# EAGLE design atxx4-485 (EAGLE 5.07)
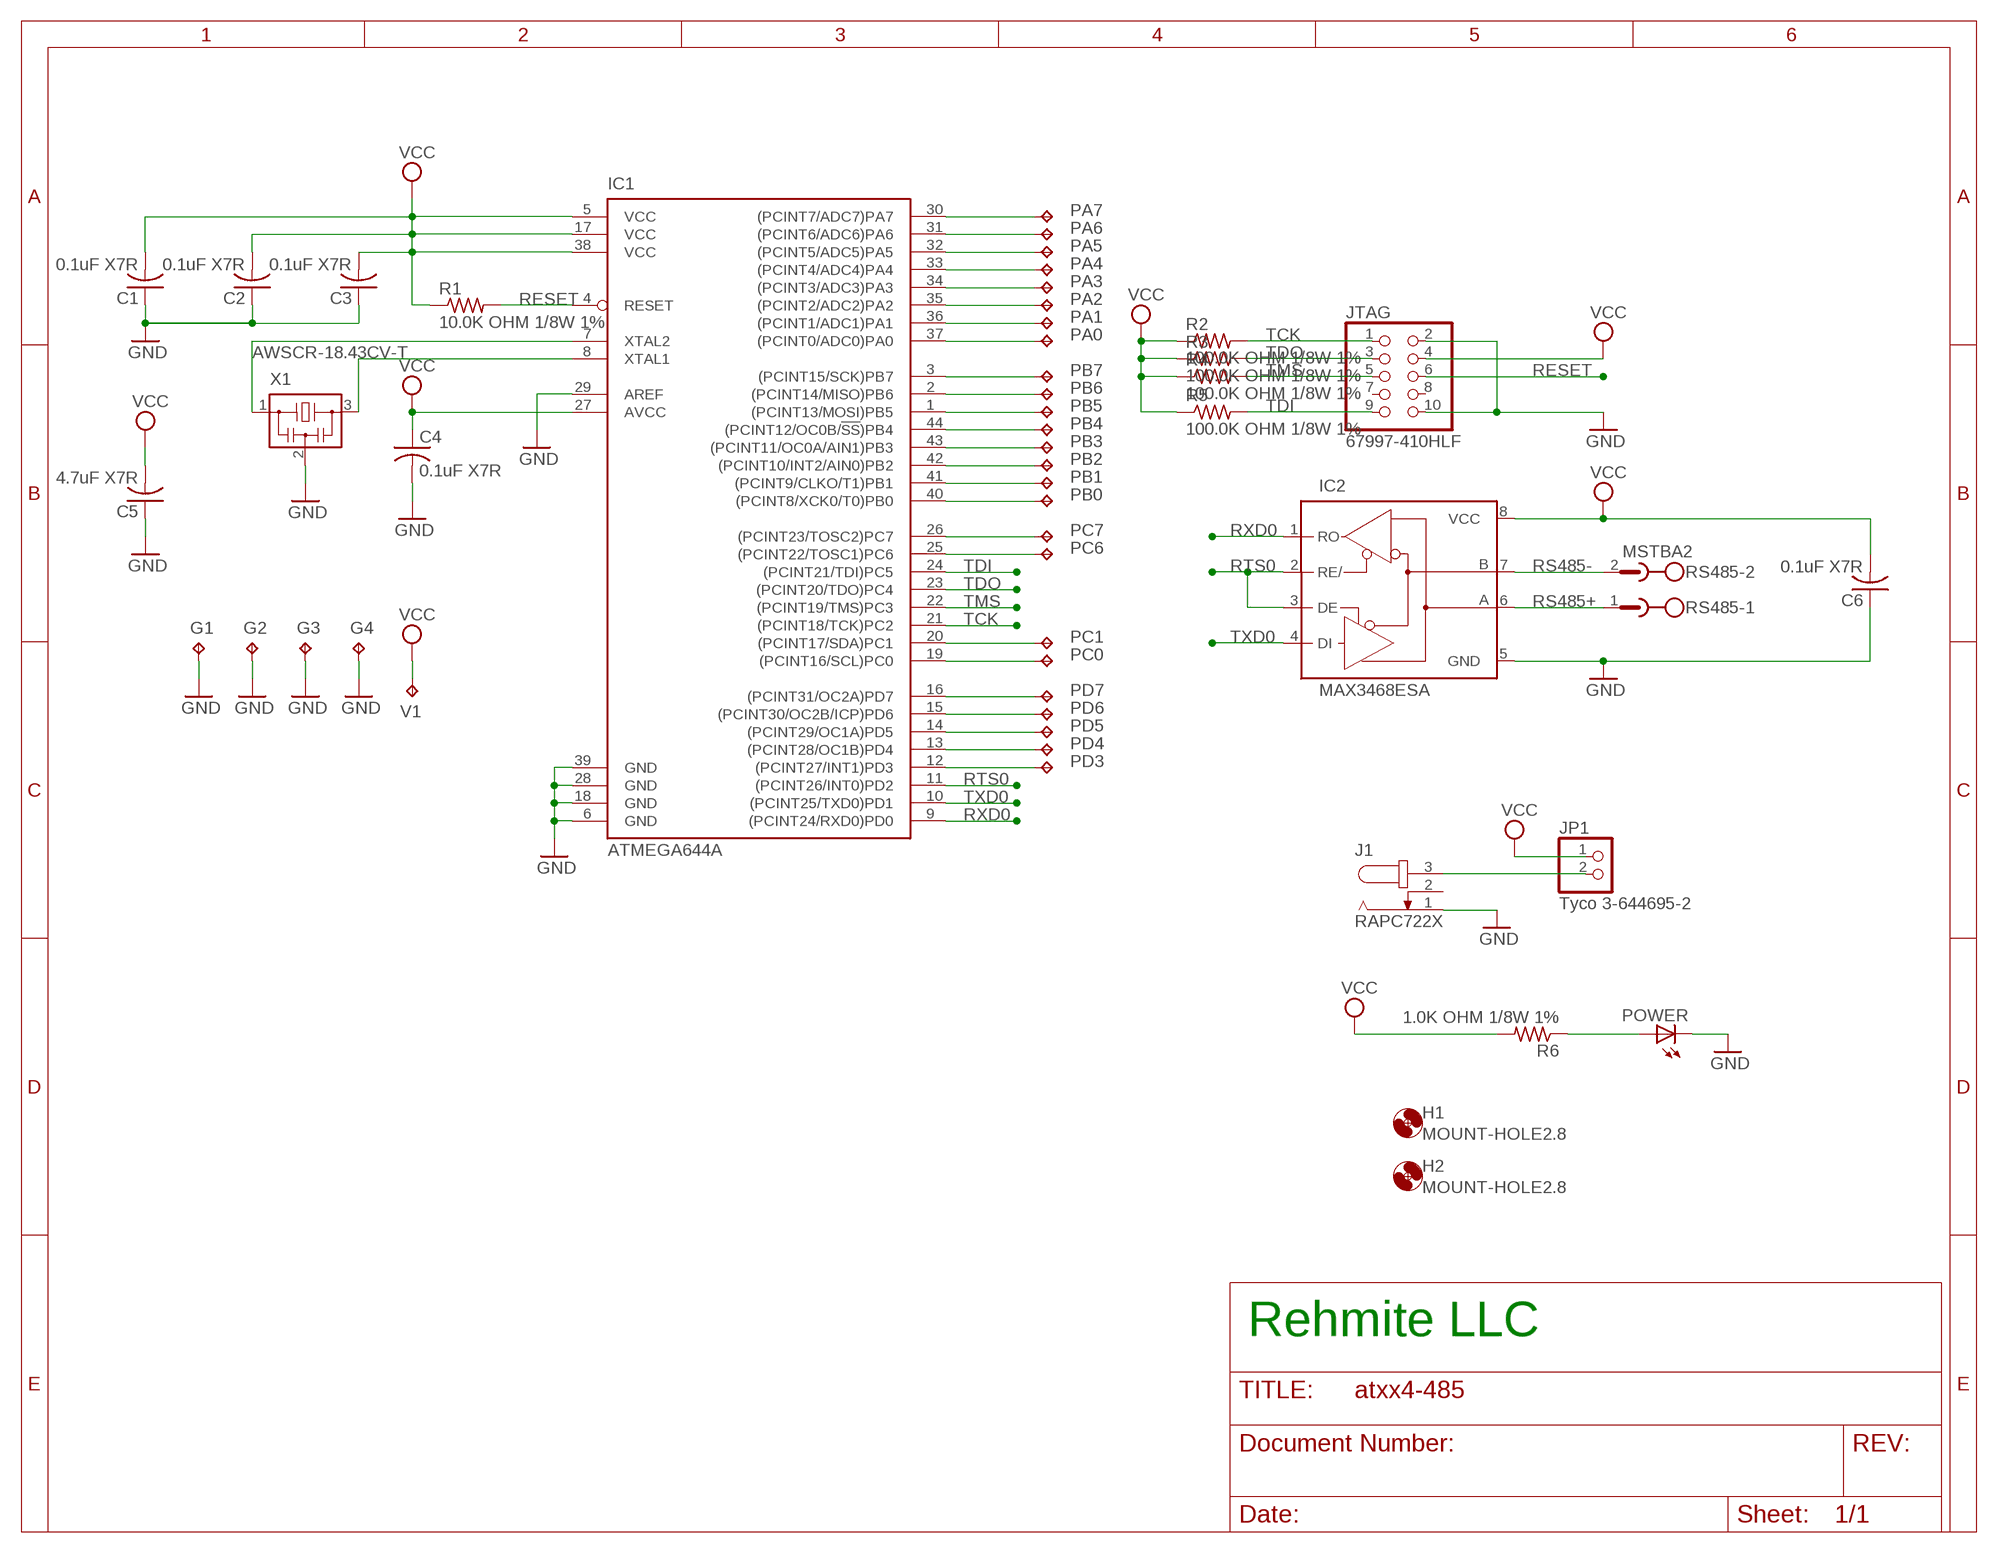
[diagram p0: schematic, sheet 1]

## Parts
C1  0.1uF X7R  C-USC0805  [C0805]
C2  0.1uF X7R  C-USC0805  [C0805]
C3  0.1uF X7R  C-USC0805  [C0805]
C4  0.1uF X7R  C-USC0805  [C0805]
C5  4.7uF X7R  C-USC0805  [C0805]
C6  0.1uF X7R  C-USC0805  [C0805]
G1  TPPAD1-13  [P1-13]
G2  TPPAD1-13  [P1-13]
G3  TPPAD1-13  [P1-13]
G4  TPPAD1-13  [P1-13]
H1  MOUNT-HOLE2.8  [2,8]
H2  MOUNT-HOLE2.8  [2,8]
IC1  ATMEGA644A  [TQFP44]
IC2  MAX3468ESA  [SO08]
J1  RAPC722X  JACK-PLUG0  [SPC4077]
JP1  Tyco 3-644695-2  PINHD-1X2  [1X02]
JTAG  67997-410HLF  PINHD-2X5  [2X05]
PA0  TPPAD1-13  [P1-13]
PA1  TPPAD1-13  [P1-13]
PA2  TPPAD1-13  [P1-13]
PA3  TPPAD1-13  [P1-13]
PA4  TPPAD1-13  [P1-13]
PA5  TPPAD1-13  [P1-13]
PA6  TPPAD1-13  [P1-13]
PA7  TPPAD1-13  [P1-13]
PB0  TPPAD1-13  [P1-13]
PB1  TPPAD1-13  [P1-13]
PB2  TPPAD1-13  [P1-13]
PB3  TPPAD1-13  [P1-13]
PB4  TPPAD1-13  [P1-13]
PB5  TPPAD1-13  [P1-13]
PB6  TPPAD1-13  [P1-13]
PB7  TPPAD1-13  [P1-13]
PC0  TPPAD1-13  [P1-13]
PC1  TPPAD1-13  [P1-13]
PC6  TPPAD1-13  [P1-13]
PC7  TPPAD1-13  [P1-13]
PD3  TPPAD1-13  [P1-13]
PD4  TPPAD1-13  [P1-13]
PD5  TPPAD1-13  [P1-13]
PD6  TPPAD1-13  [P1-13]
PD7  TPPAD1-13  [P1-13]
POWER  LED3MM  [LED3MM]
R1  10.0K OHM 1/8W 1%  R-US_R0805  [R0805]
R2  100.0K OHM 1/8W 1%  R-US_R0805  [R0805]
R3  100.0K OHM 1/8W 1%  R-US_R0805  [R0805]
R4  100.0K OHM 1/8W 1%  R-US_R0805  [R0805]
R5  100.0K OHM 1/8W 1%  R-US_R0805  [R0805]
R6  1.0K OHM 1/8W 1%  R-US_R0805  [R0805]
RS485  MSTBA2  [MSTBA2]
V1  TPPAD1-13  [P1-13]
X1  AWSCR-18.43CV-T  SWSCR-CV  [AWSCR-CV]

## Nets
GND: C1.1 C2.1 C3.1 C4.2 C5.1 C6.1 G1.TP G2.TP G3.TP G4.TP IC1.6(GND) IC1.18(GND) IC1.28(GND) IC1.29(AREF) IC1.39(GND) IC2.5(GND) J1.1 JTAG.2 JTAG.10 POWER.K(C) X1.2
N$1: IC1.3((PCINT15/SCK)PB7) PB7.TP
N$2: IC1.2((PCINT14/MISO)PB6) PB6.TP
N$3: IC1.37((PCINT0/ADC0)PA0) PA0.TP
N$4: IC1.36((PCINT1/ADC1)PA1) PA1.TP
N$5: IC1.35((PCINT2/ADC2)PA2) PA2.TP
N$6: IC1.34((PCINT3/ADC3)PA3) PA3.TP
N$7: IC1.33((PCINT4/ADC4)PA4) PA4.TP
N$8: IC1.32((PCINT5/ADC5)PA5) PA5.TP
N$9: IC1.31((PCINT6/ADC6)PA6) PA6.TP
N$10: IC1.30((PCINT7/ADC7)PA7) PA7.TP
N$11: IC1.44((PCINT12/OC0B/!SS!)PB4) PB4.TP
N$12: IC1.43((PCINT11/OC0A/AIN1)PB3) PB3.TP
N$13: IC1.42((PCINT10/INT2/AIN0)PB2) PB2.TP
N$14: IC1.41((PCINT9/CLKO/T1)PB1) PB1.TP
N$15: POWER.A R6.1
N$16: IC1.40((PCINT8/XCK0/T0)PB0) PB0.TP
N$17: IC1.26((PCINT23/TOSC2)PC7) PC7.TP
N$18: IC1.25((PCINT22/TOSC1)PC6) PC6.TP
N$19: IC1.1((PCINT13/MOSI)PB5) PB5.TP
N$20: IC1.7(XTAL2) X1.1
N$21: IC1.8(XTAL1) X1.3
N$22: J1.3 JP1.2
N$23: IC1.20((PCINT17/SDA)PC1) PC1.TP
N$24: IC1.19((PCINT16/SCL)PC0) PC0.TP
N$25: IC1.16((PCINT31/OC2A)PD7) PD7.TP
N$26: IC1.15((PCINT30/OC2B/ICP)PD6) PD6.TP
N$27: IC1.14((PCINT29/OC1A)PD5) PD5.TP
N$28: IC1.13((PCINT28/OC1B)PD4) PD4.TP
N$29: IC1.12((PCINT27/INT1)PD3) PD3.TP
RESET: IC1.4(RESET) JTAG.6 R1.2
RS485+: IC2.6(A) RS485.1
RS485-: IC2.7(B) RS485.2
RTS0: IC1.11((PCINT26/INT0)PD2) IC2.2(RE/) IC2.3(DE)
RXD0: IC1.9((PCINT24/RXD0)PD0) IC2.1(RO)
TCK: IC1.21((PCINT18/TCK)PC2) JTAG.1 R2.2
TDI: IC1.24((PCINT21/TDI)PC5) JTAG.9 R5.2
TDO: IC1.23((PCINT20/TDO)PC4) JTAG.3 R3.2
TMS: IC1.22((PCINT19/TMS)PC3) JTAG.5 R4.2
TXD0: IC1.10((PCINT25/TXD0)PD1) IC2.4(DI)
VCC: C1.2 C2.2 C3.2 C4.1 C5.2 C6.2 IC1.5(VCC) IC1.17(VCC) IC1.27(AVCC) IC1.38(VCC) IC2.8(VCC) JP1.1 JTAG.4 R1.1 R2.1 R3.1 R4.1 R5.1 R6.2 V1.TP
Unconnected: J1.2 JTAG.7 JTAG.8

## Notes on the sheet
- Rehmite LLC

## Library data of the parts
C1-C6 = rcl:C-US: CAPACITOR, American symbol
G1-G4 PA0 PA1-PA7 PB0 PB1-PB7 PC0 PC1 PC6 PC7 PD3-PD7 V1 = testpad:TP: Test pad
H1 H2 = holes:MOUNT-HOLE: MOUNTING HOLE with drill center marker
IC1 = atmel:ATMEGA644: 8-bit Microcontroller with 64K Bytes In-System Programmable Flash Source: http://www.atmel.com/dyn/resources/prod_documents/doc2593.pdf
IC2 = maxim:MAX34*: +5V, Fail-Safe, 40Mbps, Profibus RS-485/RS-422 Transceivers Source: MAX3465-MAX3469.pdf
J1 = con-jack:JACK-PLUG: DC POWER JACK Power Jack, DC, Right Angle, Through Hole, Rated 5A at 16VDC, PC Terminals Distributor: Farnell (www.Farnell.de) Drawing: 84N1161.pdf / 84N1162.pdf Manufacturer: SPC Technology (www.spctechnology.com) Type: SPC4077 / SPC 4078
JP1 = pinhead:PINHD-1X2: PIN HEADER
JTAG = pinhead:PINHD-2X5: PIN HEADER
POWER = led:LED: LED OSRAM: - CHIPLED LG R971, LG N971, LY N971, LG Q971, LY Q971, LO R971, LY R971 LH N974, LH R974 LS Q976, LO Q976, LY Q976 LO Q996 - Hyper CHIPLED LW Q18S LB Q993, LB Q99A, LB R99A - SideLED LS A670, LO A670, LY A670, LG A670, LP A670 LB A673, LV A673, LT A673, LW A673 LH A674 LY A675 LS A676, LA A676, LO A676, LY A676, LW A676 LS A679, LY A679, LG A679 - Hyper Micro SIDELED® LS Y876, LA Y876, LO Y876, LY Y876 LT Y87S - SmartLED LW L88C, LW L88S LB L89C, LB L89S, LG L890 LS L89K, LO L89K, LY L89K LS L896, LA L896, LO L896, LY L896 - TOPLED LS T670, LO T670, LY T670, LG T670, LP T670 LSG T670, LSP T670, LSY T670, LOP T670, LYG T670 LG T671, LOG T671, LSG T671 LB T673, LV T673, LT T673, LW T673 LH T674 LS T676, LA T676, LO T676, LY T676, LB T676, LH T676, LSB T676, LW T676 LB T67C, LV T67C, LT T67C, LS T67K, LO T67K, LY T67K, LW E67C LS E67B, LA E67B, LO E67B, LY E67B, LB E67C, LV E67C, LT E67C LW T67C LS T679, LY T679, LG T679 LS T770, LO T770, LY T770, LG T770, LP T770 LB T773, LV T773, LT T773, LW T773 LH T774 LS E675, LA E675, LY E675, LS T675 LS T776, LA T776, LO T776, LY T776, LB T776 LHGB T686 LT T68C, LB T68C - Hyper Mini TOPLED® LB M676 - Mini TOPLED Santana® LG M470 LS M47K, LO M47K, LY M47K Source: http://www.osram.convergy.de LUXEON: - LUMILED® LXK2-PW12-R00, LXK2-PW12-S00, LXK2-PW14-U00, LXK2-PW14-V00 LXK2-PM12-R00, LXK2-PM12-S00, LXK2-PM14-U00 LXK2-PE12-Q00, LXK2-PE12-R00, LXK2-PE12-S00, LXK2-PE14-T00, LXK2-PE14-U00 LXK2-PB12-K00, LXK2-PB12-L00, LXK2-PB12-M00, LXK2-PB14-N00, LXK2-PB14-P00, LXK2-PB14-Q00 LXK2-PR12-L00, LXK2-PR12-M00, LXK2-PR14-Q00, LXK2-PR14-R00 LXK2-PD12-Q00, LXK2-PD12-R00, LXK2-PD12-S00 LXK2-PH12-R00, LXK2-PH12-S00 LXK2-PL12-P00, LXK2-PL12-Q00, LXK2-PL12-R00 Source: www.luxeon.com KINGBRIGHT: KA-3528ASYC Source: www.kingbright.com
R1-R6 = rcl:R-US_: RESISTOR, American symbol
RS485 = con-phoenix-508:MSTBA2: PHOENIX
X1 = resonator-smd:SWSCR-CV: Abracon Resonator Source: http://www.abracon.com/Resonators/AWSCR_CV.pdf

## Board
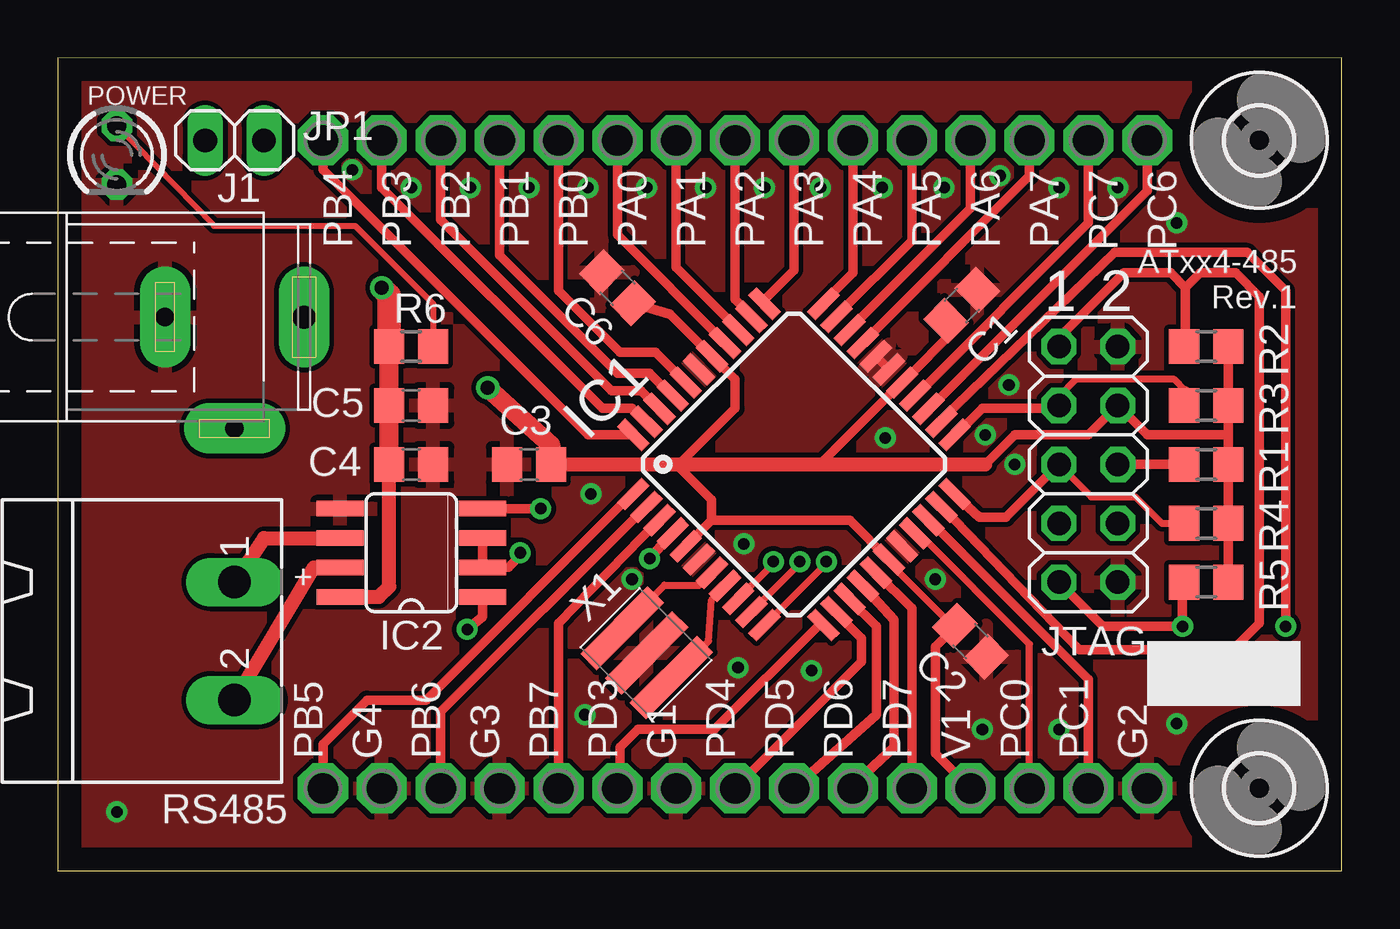
[diagram p1: board, top side]
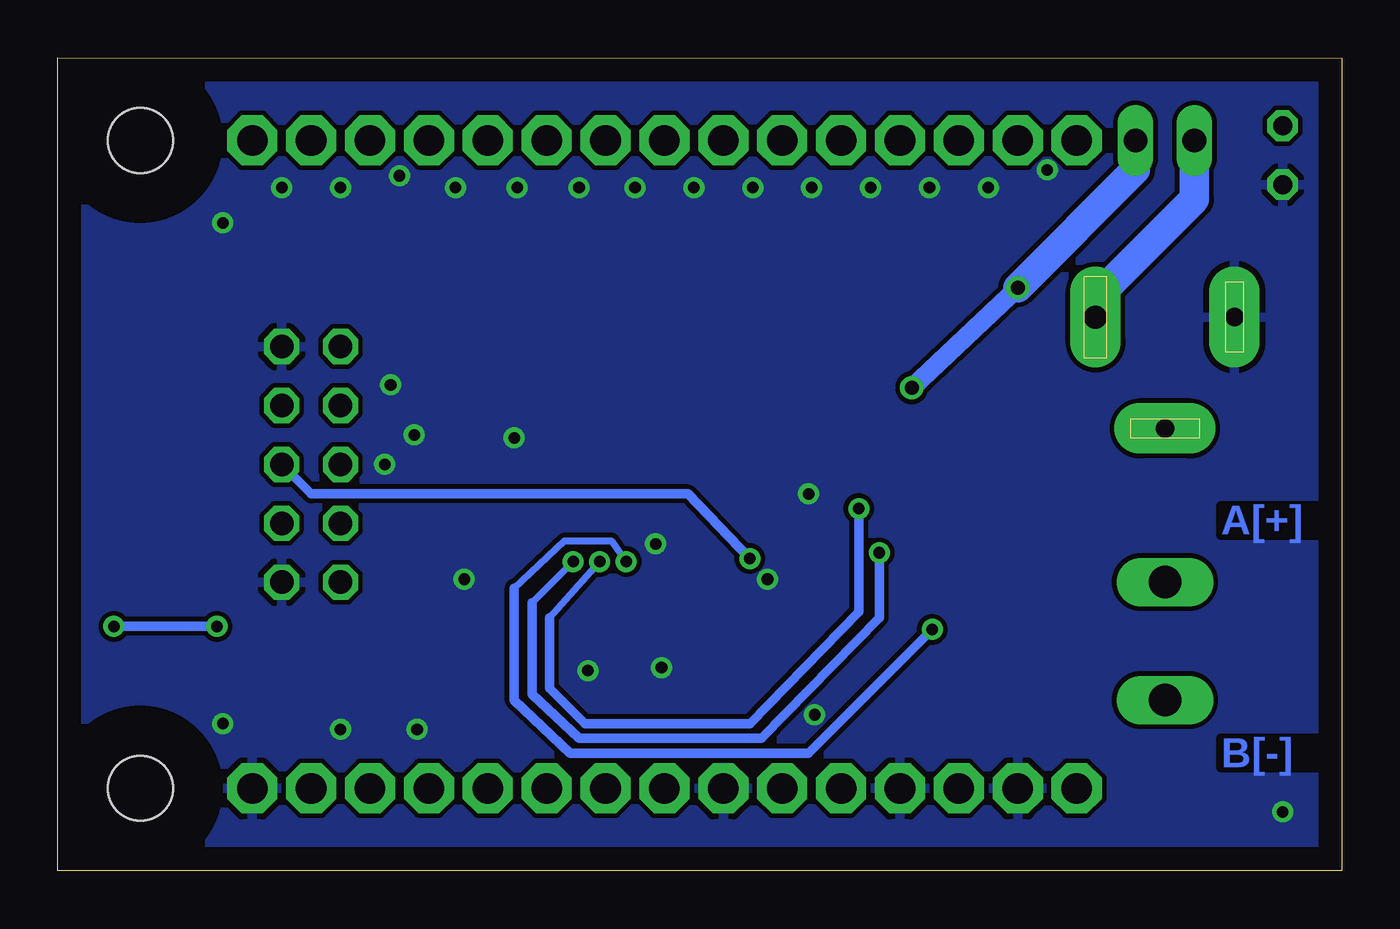
[diagram p2: board, bottom side, seen from below]

Size 55.37 x 35.05 mm. Coordinates in mm from the lower left corner, seen from the top.
Outline: 0,0 55.37,0 55.37,35.05 0,35.04 0,0
Copper layers (1*16): Top 0.035mm / dielectric 1.5mm / Bottom 0.035mm
Design rules "default *": minimum track width 10mil, minimum drill 19mil, track to track 8mil, track to pad 8mil, pad to pad 8mil, via to via 8mil, smd to smd 8mil, copper to edge 40mil, drill to drill 8mil, minimum pad ring 10mil, minimum via ring 8mil, stop-mask expansion 4mil, vias tented up to drill 0mil, thermal gap 10mil
bKeepout: area 22.7,6.6 to 28.3,12.3

### Footprints (pad centres in the part's own frame; a part is rotated, then mirrored left to right if it is on the bottom)
C0805 = smd 1.3 x 1.5: 1 -0.95,0; 2 0.95,0
P1-13 = drill 1.321 pad 2.159 octagon: TP 0,0
2,8 = hole 2.8: 0,0
TQFP44 = smd 1.5 x 0.5: 1 -5.8,4; 2 -5.8,3.2; 3 -5.8,2.4; 4 -5.8,1.6; 5 -5.8,0.8; 6 -5.8,0; 7 -5.8,-0.8; 8 -5.8,-1.6; 9 -5.8,-2.4; 10 -5.8,-3.2; 11 -5.8,-4; 23 5.8,-4; 24 5.8,-3.2; 25 5.8,-2.4; 26 5.8,-1.6; 27 5.8,-0.8; 28 5.8,0; 29 5.8,0.8; 30 5.8,1.6; 31 5.8,2.4; 32 5.8,3.2; 33 5.8,4 | smd 0.5 x 1.5: 12 -4,-5.8; 13 -3.2,-5.8; 14 -2.4,-5.8; 15 -1.6,-5.8; 16 -0.8,-5.8; 17 0,-5.8; 18 0.8,-5.8; 19 1.6,-5.8; 20 2.4,-5.8; 21 3.2,-5.8; 22 4,-5.8; 34 4,5.8; 35 3.2,5.8; 36 2.4,5.8; 37 1.6,5.8; 38 0.8,5.8; 39 0,5.8; 40 -0.8,5.8; 41 -1.6,5.8; 42 -2.4,5.8; 43 -3.2,5.8; 44 -4,5.8
SO08 = smd 0.66 x 2.032: 1 -1.905,-3.073; 2 -0.635,-3.073; 3 0.635,-3.073; 4 1.905,-3.073; 5 1.905,3.073; 6 0.635,3.073; 7 -0.635,3.073; 8 -1.905,3.073
SPC4077 = drill 0.8 pad 2.184 long: 1 -3,0; 2 0,-4.8 | drill 1 pad 2.184 long: 3 3,0
1X02 = drill 1.016 long: 1 -1.27,0; 2 1.27,0
2X05 = drill 1.016 octagon: 1 -5.08,-1.27; 2 -5.08,1.27; 3 -2.54,-1.27; 4 -2.54,1.27; 5 0,-1.27; 6 0,1.27; 7 2.54,-1.27; 8 2.54,1.27; 9 5.08,-1.27; 10 5.08,1.27
LED3MM = drill 0.813 octagon: A -1.27,0; K 1.27,0
R0805 = smd 1.3 x 1.5: 1 -0.95,0; 2 0.95,0
MSTBA2 = drill 1.397 long: 1 -2.54,5.08; 2 2.54,5.08
AWSCR-CV = smd 1 x 4.1: 1 -1.5,0; 2 0,0; 3 1.5,0

### Placement (x,y rotation side)
C1  38.99,24.38 225 top
C2  39.37,9.91 135 top
C3  20.32,17.53 0 top
C4  15.24,17.53 0 top
C5  15.24,20.07 180 top
C6  24.13,25.15 315 top
G1  26.67,3.56 0 top
G2  46.99,3.56 0 top
G3  19.05,3.56 0 top
G4  13.97,3.56 0 top
H1  51.82,3.56 0 top
H2  51.82,31.5 0 top
IC1  31.75,17.53 45 top
IC2  15.24,13.72 90 top
J1  7.62,23.88 0 top
JP1  7.62,31.5 180 top
JTAG  44.45,17.53 270 top
PA0  24.13,31.5 0 top
PA1  26.67,31.5 0 top
PA2  29.21,31.5 0 top
PA3  31.75,31.5 0 top
PA4  34.29,31.5 0 top
PA5  36.83,31.5 0 top
PA6  39.37,31.5 0 top
PA7  41.91,31.5 0 top
PB0  21.59,31.5 0 top
PB1  19.05,31.5 0 top
PB2  16.51,31.5 0 top
PB3  13.97,31.5 0 top
PB4  11.43,31.5 0 top
PB5  11.43,3.56 0 top
PB6  16.51,3.56 0 top
PB7  21.59,3.56 0 top
PC0  41.91,3.56 0 top
PC1  44.45,3.56 0 top
PC6  46.99,31.5 0 top
PC7  44.45,31.5 0 top
PD3  24.13,3.56 0 top
PD4  29.21,3.56 0 top
PD5  31.75,3.56 0 top
PD6  34.29,3.56 0 top
PD7  36.83,3.56 0 top
POWER  2.54,30.86 270 top
R1  49.53,17.53 180 top
R2  49.53,22.61 180 top
R3  49.53,20.07 180 top
R4  49.53,14.99 180 top
R5  49.53,12.45 180 top
R6  15.24,22.61 180 top
RS485  2.54,9.91 270 top
V1  39.37,3.56 0 top
X1  25.4,9.4 315 top

### Tracks (layer width: path | path; a pad name or v marks a point on that pad's centre or on a via)
GND  (via drill 0.5)
  Top 0.406: IC1.29 IC1.28
  other vias: 2.54,2.54 15.24,29.46 17.78,29.46 20.32,29.46 22.86,29.46 25.4,29.46 27.94,29.46 30.48,29.46 32.89,29.46 35.56,29.46 38.23,29.46 40.64,29.97 43.18,29.46 45.72,29.46 48.26,27.94 48.26,6.35 39.88,6.1 43.18,6.1 29.34,8.76 29.59,14.1 37.85,12.57 32.51,8.64 22.99,16.26 35.69,18.67 22.73,6.73 12.7,30.23 41.02,20.95 40.01,18.8 41.27,17.53 24.77,12.57
  pour Bottom: 0,35.05 55.37,35.05 55.37,0 0,0
  pour Top: 0,35.05 0,0 55.37,0 55.37,35.05
N$1
  Top 0.406: IC1.3 25.92,15.12 21.59,10.67 PB7.TP
N$2
  Top 0.406: IC1.2 25.34,15.69 16.51,6.86 PB6.TP
N$3
  Top 0.406: IC1.37 28.78,22.78 24.13,27.43 PA0.TP
N$4
  Top 0.406: IC1.36 29.35,23.36 26.67,26.04 PA1.TP
N$5
  Top 0.406: IC1.35 29.91,23.94 29.21,24.64 PA2.TP
N$6
  Top 0.406: IC1.34 30.48,24.64 31.75,25.91 PA3.TP
N$7
  Top 0.406: IC1.33 33.02,24.51 34.29,25.78 PA4.TP
N$8
  Top 0.406: IC1.32 33.59,23.94 36.83,27.18 PA5.TP
N$9
  Top 0.406: IC1.31 34.15,23.36 39.37,28.57 PA6.TP
N$10
  Top 0.406: IC1.30 34.72,22.78 41.91,29.97 PA7.TP
N$11
  Top 0.406: IC1.44 22.86,18.8 11.43,30.23 PB4.TP
N$12
  Top 0.406: IC1.43 25.34,19.36 24.77,19.94 23.5,19.94 13.97,29.46 PB3.TP
N$13
  Top 0.406: IC1.42 25.92,19.93 25.15,20.7 23.88,20.7 16.51,28.07 PB2.TP
N$14
  Top 0.406: IC1.41 26.49,20.5 25.53,21.46 24.13,21.46 19.05,26.54 PB1.TP
N$15
  Top 0.254: R6.1 16.19,24.45 12.83,27.81 6.73,27.81 POWER.A
N$16
  Top 0.406: IC1.40 25.78,22.35 24.26,22.35 21.59,25.02 PB0.TP
N$17
  Top 0.406: IC1.26 37.01,20.5 44.45,27.94 PC7.TP
N$18
  Top 0.406: IC1.25 37.58,19.93 46.99,29.34 PC6.TP
N$19
  Top 0.406: IC1.1 24.76,16.25 15.88,7.37 13.34,7.37 11.43,5.46 PB5.TP
N$20
  Top 0.305: 25.4,11.56 26.16,12.32 27.69,12.32 IC1.7
  Top 0.406: X1.1 25.4,11.56
N$21
  Top 0.305: 26.92,8.76 28.07,9.91 28.19,11.68 28.78,12.27
  Top 0.406: X1.3 26.92,8.76 | 28.78,12.27 IC1.8
N$22
  Bottom 1.27: J1.3 10.62,24.69 6.35,28.96 JP1.2
N$23
  Top 0.406: IC1.20 37.58,15.12 44.45,8.26 PC1.TP
N$24
  Top 0.305: 37.01,14.56 37.13,14.56 41.91,9.78 PC0.TP
  Top 0.406: 37.01,14.56 IC1.19
N$25
  Top 0.406: PD7.TP 36.83,11.31 IC1.16
N$26
  Top 0.406: PD6.TP 34.29,3.68 36.07,5.33 36.07,10.82 IC1.15
N$27
  Top 0.406: IC1.14 34.15,11.69 35.31,10.54 35.31,6.73 PD5.TP
N$28
  Top 0.406: IC1.13 33.59,11.12 34.67,10.03 34.67,9.02 PD4.TP
N$29
  Top 0.406: IC1.12 32.82,10.6 28.32,6.1 25.02,6.1 24.26,5.33 24.26,3.68 PD3.TP
RESET  (via drill 0.5)
  Top 0.406: IC1.4 26.49,14.56 v25.53,13.46 | JTAG.6 R1.2
  Bottom 0.406: v25.53,13.46 28.19,16.26 44.45,16.26 JTAG.6
RS485+
  Top 0.61: IC2.6 8.89,14.35 RS485.1
RS485-
  Top 0.61: IC2.7 11.05,13.08 RS485.2
RTS0  (via drill 0.5)
  Top 0.305: 33.15,13.27 IC1.11
  Top 0.406: IC2.3 IC2.2 19.43,13.08 19.94,13.59 v19.94,13.72 | v33.15,13.34 33.15,13.27
  Bottom 0.305: 34.92,11.56 v33.15,13.34
  Bottom 0.406: v19.94,13.72 19.94,10.92 25.02,5.71 32.89,5.71 34.92,7.62 34.92,11.56
RXD0  (via drill 0.5)
  Top 0.305: v30.86,13.34 30.61,12.99 IC1.9
  Top 0.406: IC2.1 18.31,10.95 v17.65,10.41
  Bottom 0.305: 35.69,12.19 33.53,14.22 31.5,14.22 v30.86,13.34
  Bottom 0.406: v17.65,10.41 22.99,5.08 33.27,5.08 35.69,7.37 35.69,12.19
TCK
  Top 0.406: JTAG.1 43.18,22.99 45.97,25.78 48.01,25.78 48.64,25.15 | 48.64,22.67 R2.2 48.64,22.67 | IC1.21 38.16,15.69 44.07,9.53 50.67,9.53 51.82,10.67 51.82,24.77 50.8,25.78 49.28,25.78 48.64,25.15 | 48.64,25.15 48.64,22.67
TDI  (via drill 0.5)
  Top 0.406: IC1.24 38.11,19.45 45.59,26.67 51.31,26.67 52.96,25.02 v52.96,10.54 | R5.2 48.51,12.38 v48.51,10.54 45.09,10.54 JTAG.9
  Bottom 0.406: v48.51,10.54 v52.96,10.54
TDO
  Top 0.305: JTAG.3 43.18,20.45 43.94,21.21 48.13,21.21 48.64,20.7
  Top 0.406: 48.64,20.7 48.64,20.13 R3.2 | IC1.23 38.74,18.8 39.88,19.94 43.05,19.94 JTAG.3
TMS
  Top 0.305: R4.2 47.62,14.99 46.48,16.13 44.58,16.13 JTAG.5
  Top 0.406: JTAG.5 40.89,15.24 39.75,15.24 39.06,15.88 IC1.22
TXD0  (via drill 0.5)
  Top 0.305: v32,13.34 31.88,13.13 IC1.10
  Top 0.406: v20.83,15.62 IC2.4
  Bottom 0.305: 34.16,10.92 v32,13.34
  Bottom 0.406: v20.83,15.62 20.83,11.18 25.53,6.35 32.64,6.35 34.16,7.87 34.16,10.92
VCC  (via drill 0.6)
  Top 0.305: IC1.17 35.85,13.3 38.48,10.67 C2.2
  Top 0.406: C6.2 26.4,24 IC1.38 29.21,21.2 29.21,19.94 26.8,17.53 26.67,17.53 28.19,16 28.19,15.11 | C1.2 38.42,23.05 36.83,21.46 36.82,21.46 IC1.27 32.88,17.53 | IC1.5 27.08,14 28.19,15.11 | 28.19,15.11 34.16,15.11 IC1.17 | R2.1 R3.1 50.48,18.8 | 50.48,18.8 R1.1 R4.1 R5.1 | 38.7,4.23 V1.TP 37.85,5.08 37.85,9.65 38.7,10.5 C2.2 | 40.01,17.53 41.27,18.8 44.45,18.8 JTAG.4 46.99,18.8 50.48,18.8
  Top 0.61: C4.1 14.29,12.26 13.84,11.81 IC2.8 | C3.2 26.67,17.53 | 26.8,17.53 32.88,17.53 40.01,17.53
  Top 0.813: R6.2 C5.2 C4.1 | C3.2 21.27,18.35 v18.54,20.83
  Top 1.016: R6.2 14.29,24.83 v13.97,25.15
  Bottom 0.813: v13.97,25.15 v18.54,20.83
  Bottom 1.27: JP1.1 8.89,30.23 v13.97,25.15

### Text on the board
Bottom: A[+] | B[-]
tNames: ATxx4-485 | Rev.1 | 1 | 2 | +